# EAGLE schematic LogicPCB (EAGLE 9.4.2)
Assembly variants: СЫЧ

## Sheet 1 of 2
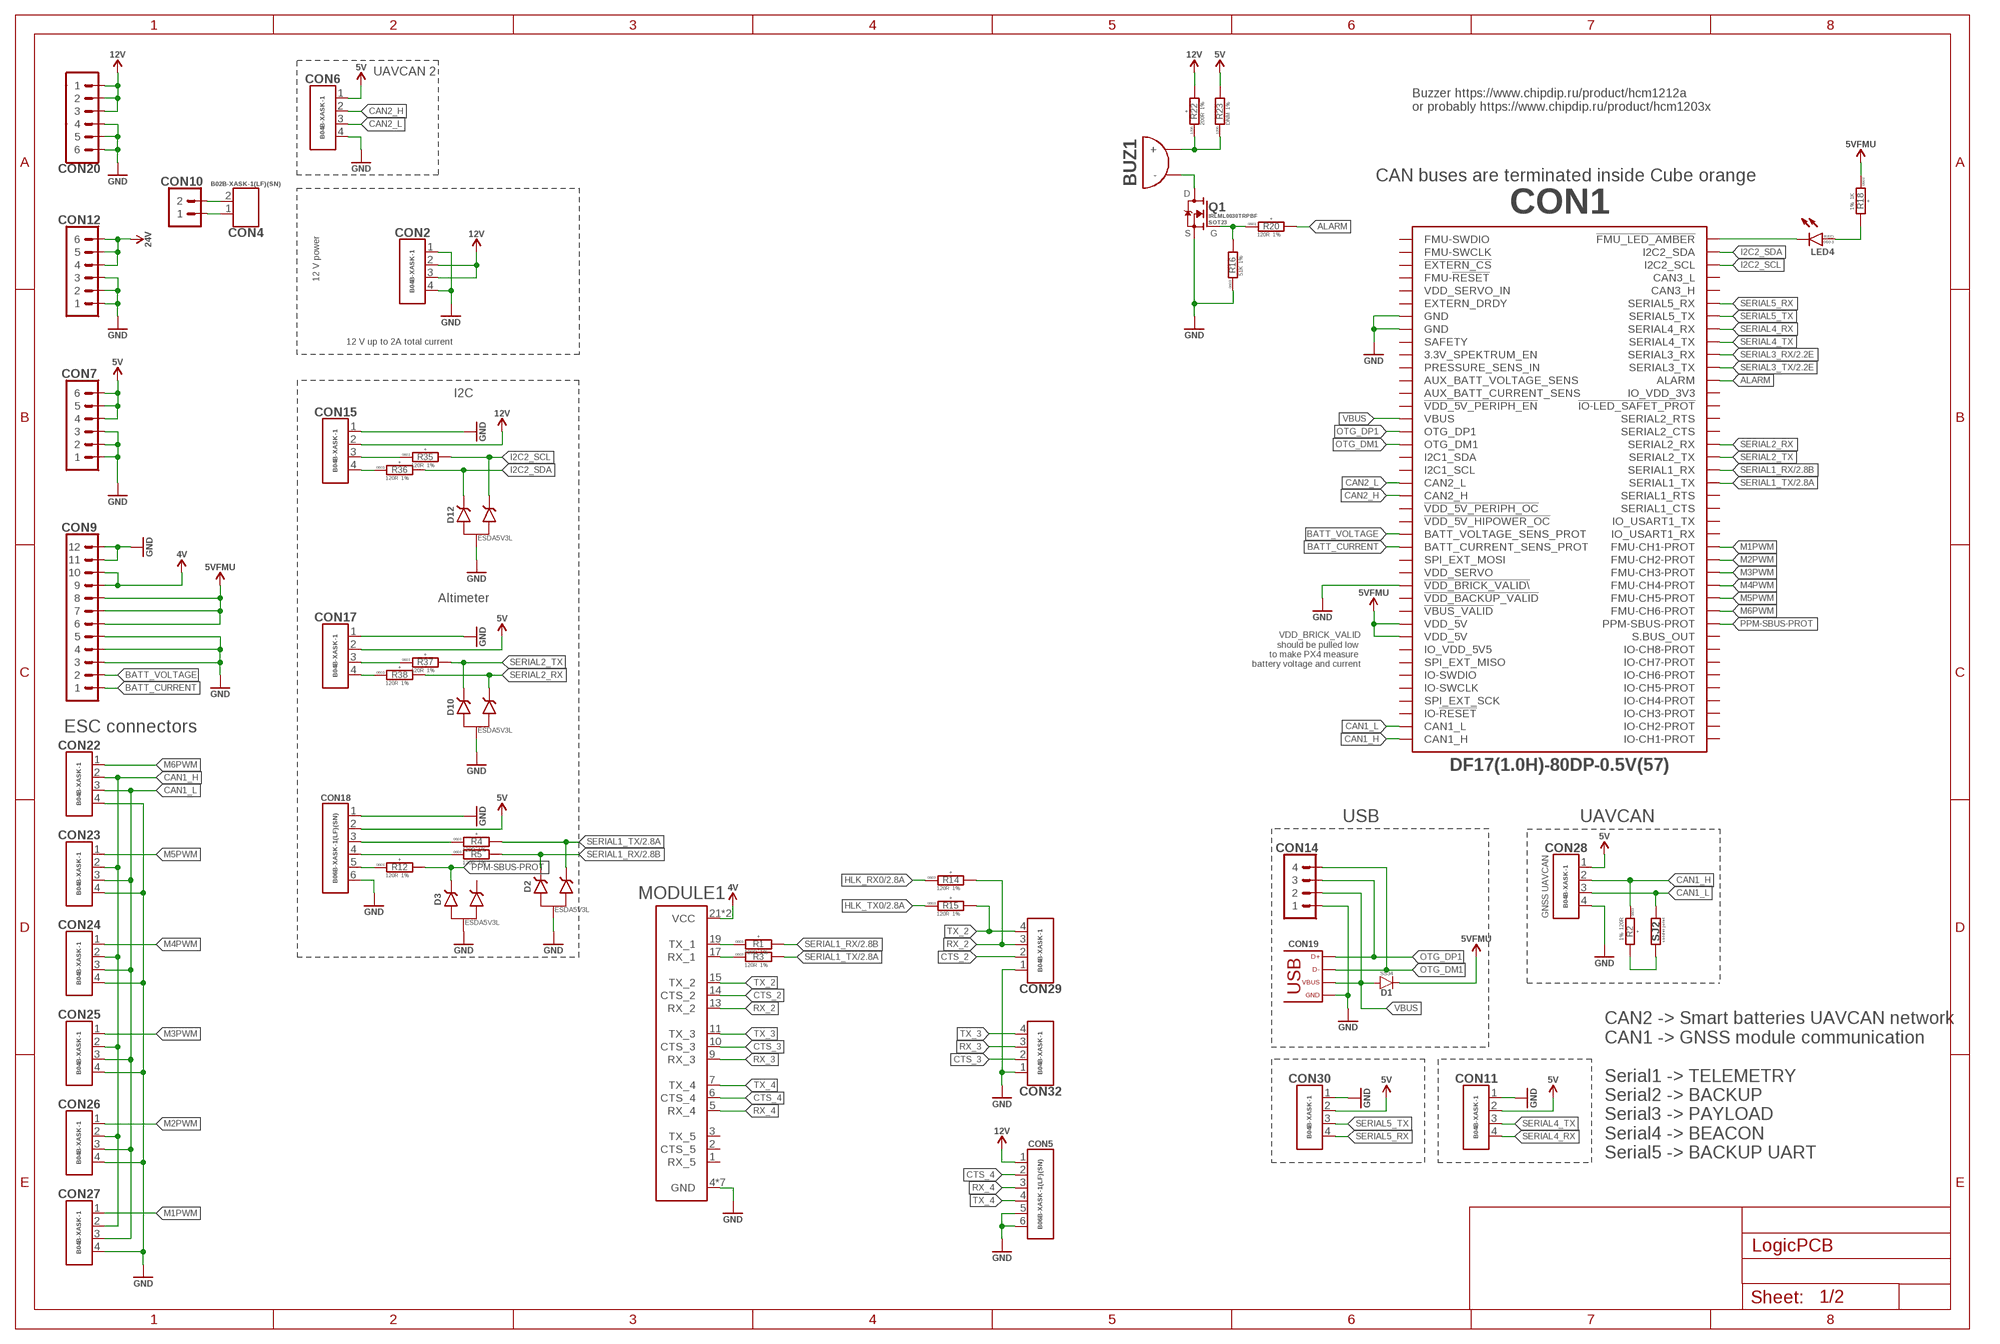
[diagram p0: schematic, sheet 1]

### Parts
BUZ1  BUZZER-ЕР-12MM  [BUZZER_12MM]
CON1  CUBE_ORANGE_  [CUBE_ORANGE]
CON2  CON-4P-JST-XA  [B04B-XASK-1]
CON4  CON-2P-JST-XA  [B02B-XASK-1]
CON5  CON-6P-JST-XA  [B06B-XASK-1]
CON6  CON-4P-JST-XA  [B04B-XASK-1]
CON7  PINHEAD_1X06-2.54  [1X06-PTH-2.54]
CON9  PINHEAD_1X12-2.54  [1X12-PTH-2.54]
CON10  PINHEAD_1X02-2.54  [1X02-PTH-2.54]
CON11  CON-4P-JST-XA  [B04B-XASK-1]
CON12  PINHEAD_1X06-2.54  [1X06-PTH-2.54]
CON14  PINHEAD_1X04-2.54  [1X04-PTH-2.54]  (not fitted in variant СЫЧ)
CON15  CON-4P-JST-XA  [B04B-XASK-1]
CON17  CON-4P-JST-XA  [B04B-XASK-1]
CON18  CON-6P-JST-XA  [B06B-XASK-1]
CON19  USB-TYPE-C-VERT-PROD  [2047110001-PROD]
CON20  PINHEAD_1X06-2.54  [1X06-PTH-2.54]
CON22  CON-4P-JST-XA  [B04B-XASK-1]
CON23  CON-4P-JST-XA  [B04B-XASK-1]
CON24  CON-4P-JST-XA  [B04B-XASK-1]
CON25  CON-4P-JST-XA  [B04B-XASK-1]
CON26  CON-4P-JST-XA  [B04B-XASK-1]
CON27  CON-4P-JST-XA  [B04B-XASK-1]
CON28  CON-4P-JST-XA  [B04B-XASK-1]
CON29  CON-4P-JST-XA  [B04B-XASK-1]
CON30  CON-4P-JST-XA  [B04B-XASK-1]
CON32  CON-4P-JST-XA  [B04B-XASK-1]
D1  SS34  [DO-214AC(SMA)]
D2  ESDA5V3L  [SOT23B-3]  (not fitted in variant СЫЧ)
D3  ESDA5V3L  [SOT23B-3]
D10  ESDA5V3L  [SOT23B-3]
D12  ESDA5V3L  [SOT23B-3]
LED4  LED-0603  [LED0603]
MODULE1  MODEM_CARRIER  [MODEM_CARRIER]
Q1  IRLML0030  [SOT23]
R1  120R  R-1%-0603  [R0603]
R2  120R  R-1%-0603  [R0603]
R3  120R  R-1%-0603  [R0603]
R4  120R  R-1%-0603  [R0603]  (not fitted in variant СЫЧ)
R5  120R  R-1%-0603  [R0603]  (not fitted in variant СЫЧ)
R12  120R  R-1%-0603  [R0603]
R14  120R  R-1%-0603  [R0603]  (not fitted in variant СЫЧ)
R15  120R  R-1%-0603  [R0603]  (not fitted in variant СЫЧ)
R16  51K  R-1%-0603  [R0603]
R18  1K  R-1%-0603  [R0603]
R20  120R  R-1%-0603  [R0603]
R22  200R  R-1%-1206  [R1206]
R23  DNM  R-1%-1206  [R1206]  (not fitted in variant СЫЧ)
R35  120R  R-1%-0603  [R0603]
R36  120R  R-1%-0603  [R0603]
R37  120R  R-1%-0603  [R0603]
R38  120R  R-1%-0603  [R0603]
SJ2  SOLDER_JOINT-SJ1  [RES_0]  (not fitted in variant СЫЧ)

### Nets
5VFMU: CON1.61(VDD_5V) CON1.63(VDD_5V) CON9.6 CON9.7 CON9.8 D1.C R18.1
!FMU_LED_AMBER: CON1.2(!FMU_LED_AMBER) LED4.C
ALARM: CON1.24(ALARM) R20.2
BATT_CURRENT: CON1.49(BATT_CURRENT_SENS_PROT) CON9.1
BATT_VOLTAGE: CON1.47(BATT_VOLTAGE_SENS_PROT) CON9.2
CAN1_H: CON1.79(CAN1_H) CON22.2 CON23.2 CON24.2 CON25.2 CON26.2 CON27.2 CON28.2 R2.1
CAN1_L: CON1.77(CAN1_L) CON22.3 CON23.3 CON24.3 CON25.3 CON26.3 CON27.3 CON28.3 SJ2.2
CAN2_H: CON1.41(CAN2_H) CON6.2
CAN2_L: CON1.39(CAN2_L) CON6.3
CTS_2: CON29.2 MODULE1.14(CTS_2)
CTS_3: CON32.2 MODULE1.10(CTS_3)
CTS_4: CON5.2 MODULE1.6(CTS_4)
GND: CON1.13(GND) CON1.15(GND) CON1.55(!VDD_BRICK_VALID\) CON2.1 CON2.4 CON5.5 CON5.6 CON6.4 CON7.1 CON7.2 CON7.3 CON9.3 CON9.4 CON9.5 CON9.11 CON9.12 CON11.1 CON12.1 CON12.2 CON12.3 CON14.1 CON15.1 CON17.1 CON18.1 CON18.6 CON19.A1(GND) CON19.A12(GND) CON19.B1(GND) CON19.B12(GND) CON19.G1(GND) CON19.G2(GND) CON19.G4(GND) CON19.G5(GND) CON19.G7(GND) CON19.G8(GND) CON19.G9(GND) CON19.G10(GND) CON19.P$1(GND) CON19.P$2(GND) CON20.4 CON20.5 CON20.6 CON22.4 CON23.4 CON24.4 CON25.4 CON26.4 CON27.4 CON28.4 CON29.1 CON30.1 CON32.1 D2.3(A) D3.3(A) D10.3(A) D12.3(A) MODULE1.4(GND) MODULE1.8(GND) MODULE1.12(GND) MODULE1.16(GND) MODULE1.20(GND) MODULE1.22(GND) MODULE1.24(GND) Q1.2(S) R16.1 ; also sheet 2
HLK_RX0: R14.1 ; also sheet 2
HLK_TX0: R15.1 ; also sheet 2
I2C2_SCL: CON1.6(I2C2_SCL) D12.2(C1) R35.2
I2C2_SDA: CON1.4(I2C2_SDA) D12.1(C) R36.2
M1PWM: CON1.50(FMU-CH1-PROT) CON27.1
M2PWM: CON1.52(FMU-CH2-PROT) CON26.1
M3PWM: CON1.54(FMU-CH3-PROT) CON25.1
M4PWM: CON1.56(FMU-CH4-PROT) CON24.1
M5PWM: CON1.58(FMU-CH5-PROT) CON23.1
M6PWM: CON1.60(FMU-CH6-PROT) CON22.1
N$1: LED4.A R18.2
N$2: CON4.1 CON10.1
N$3: BUZ1.2(-) Q1.3(D)
N$4: MODULE1.19(TX_1) R1.1
N$5: Q1.1(G) R16.2 R20.1
N$6: MODULE1.17(RX_1) R3.1
N$7: CON4.2 CON10.2
N$8: R2.2 SJ2.1
N$9: CON18.3 R4.1
N$10: CON18.4 R5.1
N$13: BUZ1.1(+) R22.P$1 R23.P$1
N$18: CON18.5 R12.1
N$20: CON15.3 R35.1
N$21: CON15.4 R36.1
N$22: CON17.3 R37.1
N$23: CON17.4 R38.1
OTG_DM1: CON1.33(OTG_DM1) CON14.4 CON19.A7(D-) CON19.B7(D-)
OTG_DP1: CON1.31(OTG_DP1) CON14.3 CON19.A6(D+) CON19.B6(D+)
PPM-SBUS-PROT: CON1.62(PPM-SBUS-PROT) D3.1(C) R12.2
RX_2: CON29.3 MODULE1.13(RX_2) R14.2
RX_3: CON32.3 MODULE1.9(RX_3)
RX_4: CON5.3 MODULE1.5(RX_4)
SERIAL1_RX: CON1.38(SERIAL1_RX) D2.1(C) R1.2 R5.2 ; also sheet 2
SERIAL1_TX: CON1.40(SERIAL1_TX) D2.2(C1) R3.2 R4.2 ; also sheet 2
SERIAL2_RX: CON1.34(SERIAL2_RX) D10.2(C1) R38.2
SERIAL2_TX: CON1.36(SERIAL2_TX) D10.1(C) R37.2
SERIAL3_RX: CON1.20(SERIAL3_RX) ; also sheet 2
SERIAL3_TX: CON1.22(SERIAL3_TX) ; also sheet 2
SERIAL4_RX: CON1.16(SERIAL4_RX) CON11.4
SERIAL4_TX: CON1.18(SERIAL4_TX) CON11.3
SERIAL5_RX: CON1.12(SERIAL5_RX) CON30.4
SERIAL5_TX: CON1.14(SERIAL5_TX) CON30.3
TX_2: CON29.4 MODULE1.15(TX_2) R15.2
TX_3: CON32.4 MODULE1.11(TX_3)
TX_4: CON5.4 MODULE1.7(TX_4)
VBUS: CON1.29(VBUS) CON14.2 CON19.A4(VBUS) CON19.B4(VBUS) D1.A
VDD_4V: CON9.9 CON9.10 MODULE1.21(VCC) MODULE1.23(VCC) ; supply symbol labelled 4V
VDD_5V: CON6.1 CON7.4 CON7.5 CON7.6 CON11.2 CON17.2 CON18.2 CON28.1 CON30.2 R23.P$2 ; supply symbol labelled 5V
VDD_12V: CON2.2 CON2.3 CON5.1 CON15.2 CON20.1 CON20.2 CON20.3 R22.P$2 ; supply symbol labelled 12V ; also sheet 2
VDD_24V: CON12.4 CON12.5 CON12.6 ; supply symbol labelled 24V ; also sheet 2
Unconnected: CON1.1(FMU-SWDIO) CON1.3(FMU-SWCLK) CON1.5(!EXTERN_CS) CON1.7(FMU-!RESET) CON1.8(CAN3_L) CON1.9(VDD_SERVO_IN) CON1.10(CAN3_H) CON1.11(EXTERN_DRDY) CON1.17(SAFETY) CON1.19(3.3V_SPEKTRUM_EN) CON1.21(PRESSURE_SENS_IN) CON1.23(AUX_BATT_VOLTAGE_SENS) CON1.25(AUX_BATT_CURRENT_SENS) CON1.26(IO_VDD_3V3) CON1.27(!VDD_5V_PERIPH_EN) CON1.28(!IO-LED_SAFET_PROT) CON1.30(SERIAL2_RTS) CON1.32(SERIAL2_CTS) CON1.35(I2C1_SDA) CON1.37(I2C1_SCL) CON1.42(SERIAL1_RTS) CON1.43(!VDD_5V_PERIPH_OC) CON1.44(SERIAL1_CTS) CON1.45(!VDD_5V_HIPOWER_OC) CON1.46(IO_USART1_TX) CON1.48(IO_USART1_RX) CON1.51(SPI_EXT_MOSI) CON1.53(VDD_SERVO) CON1.57(!VDD_BACKUP_VALID) CON1.59(!VBUS_VALID) CON1.64(S.BUS_OUT) CON1.65(IO_VDD_5V5) CON1.66(IO-CH8-PROT) CON1.67(SPI_EXT_MISO) CON1.68(IO-CH7-PROT) CON1.69(IO-SWDIO) CON1.70(IO-CH6-PROT) CON1.71(IO-SWCLK) CON1.72(IO-CH5-PROT) CON1.73(SPI_EXT_SCK) CON1.74(IO-CH4-PROT) CON1.75(IO-!RESET) CON1.76(IO-CH3-PROT) CON1.78(IO-CH2-PROT) CON1.80(IO-CH1-PROT) D3.2(C1) MODULE1.1(RX_5) MODULE1.2(CTS_5) MODULE1.3(TX_5)

### Notes on the sheet
- UAVCAN 2
- Buzzer https://www.chipdip.ru/product/hcm1212a
  or probably https://www.chipdip.ru/product/hcm1203x
- CAN buses are terminated inside Cube orange
- 12 V power
- 12 V up to 2A total current
- I2C
- Altimeter
- VDD_BRICK_VALID
  should be pulled low 
  to make PX4 measure 
  battery voltage and current
- ESC connectors
- USB | UAVCAN
- GNSS UAVCAN
- CAN2 -> Smart batteries UAVCAN network
  CAN1 -> GNSS module communication
  
  Serial1 -> TELEMETRY
  Serial2 -> BACKUP 
  Serial3 -> PAYLOAD
  Serial4 -> BEACON
  Serial5 -> BACKUP UART

## Sheet 2 of 2
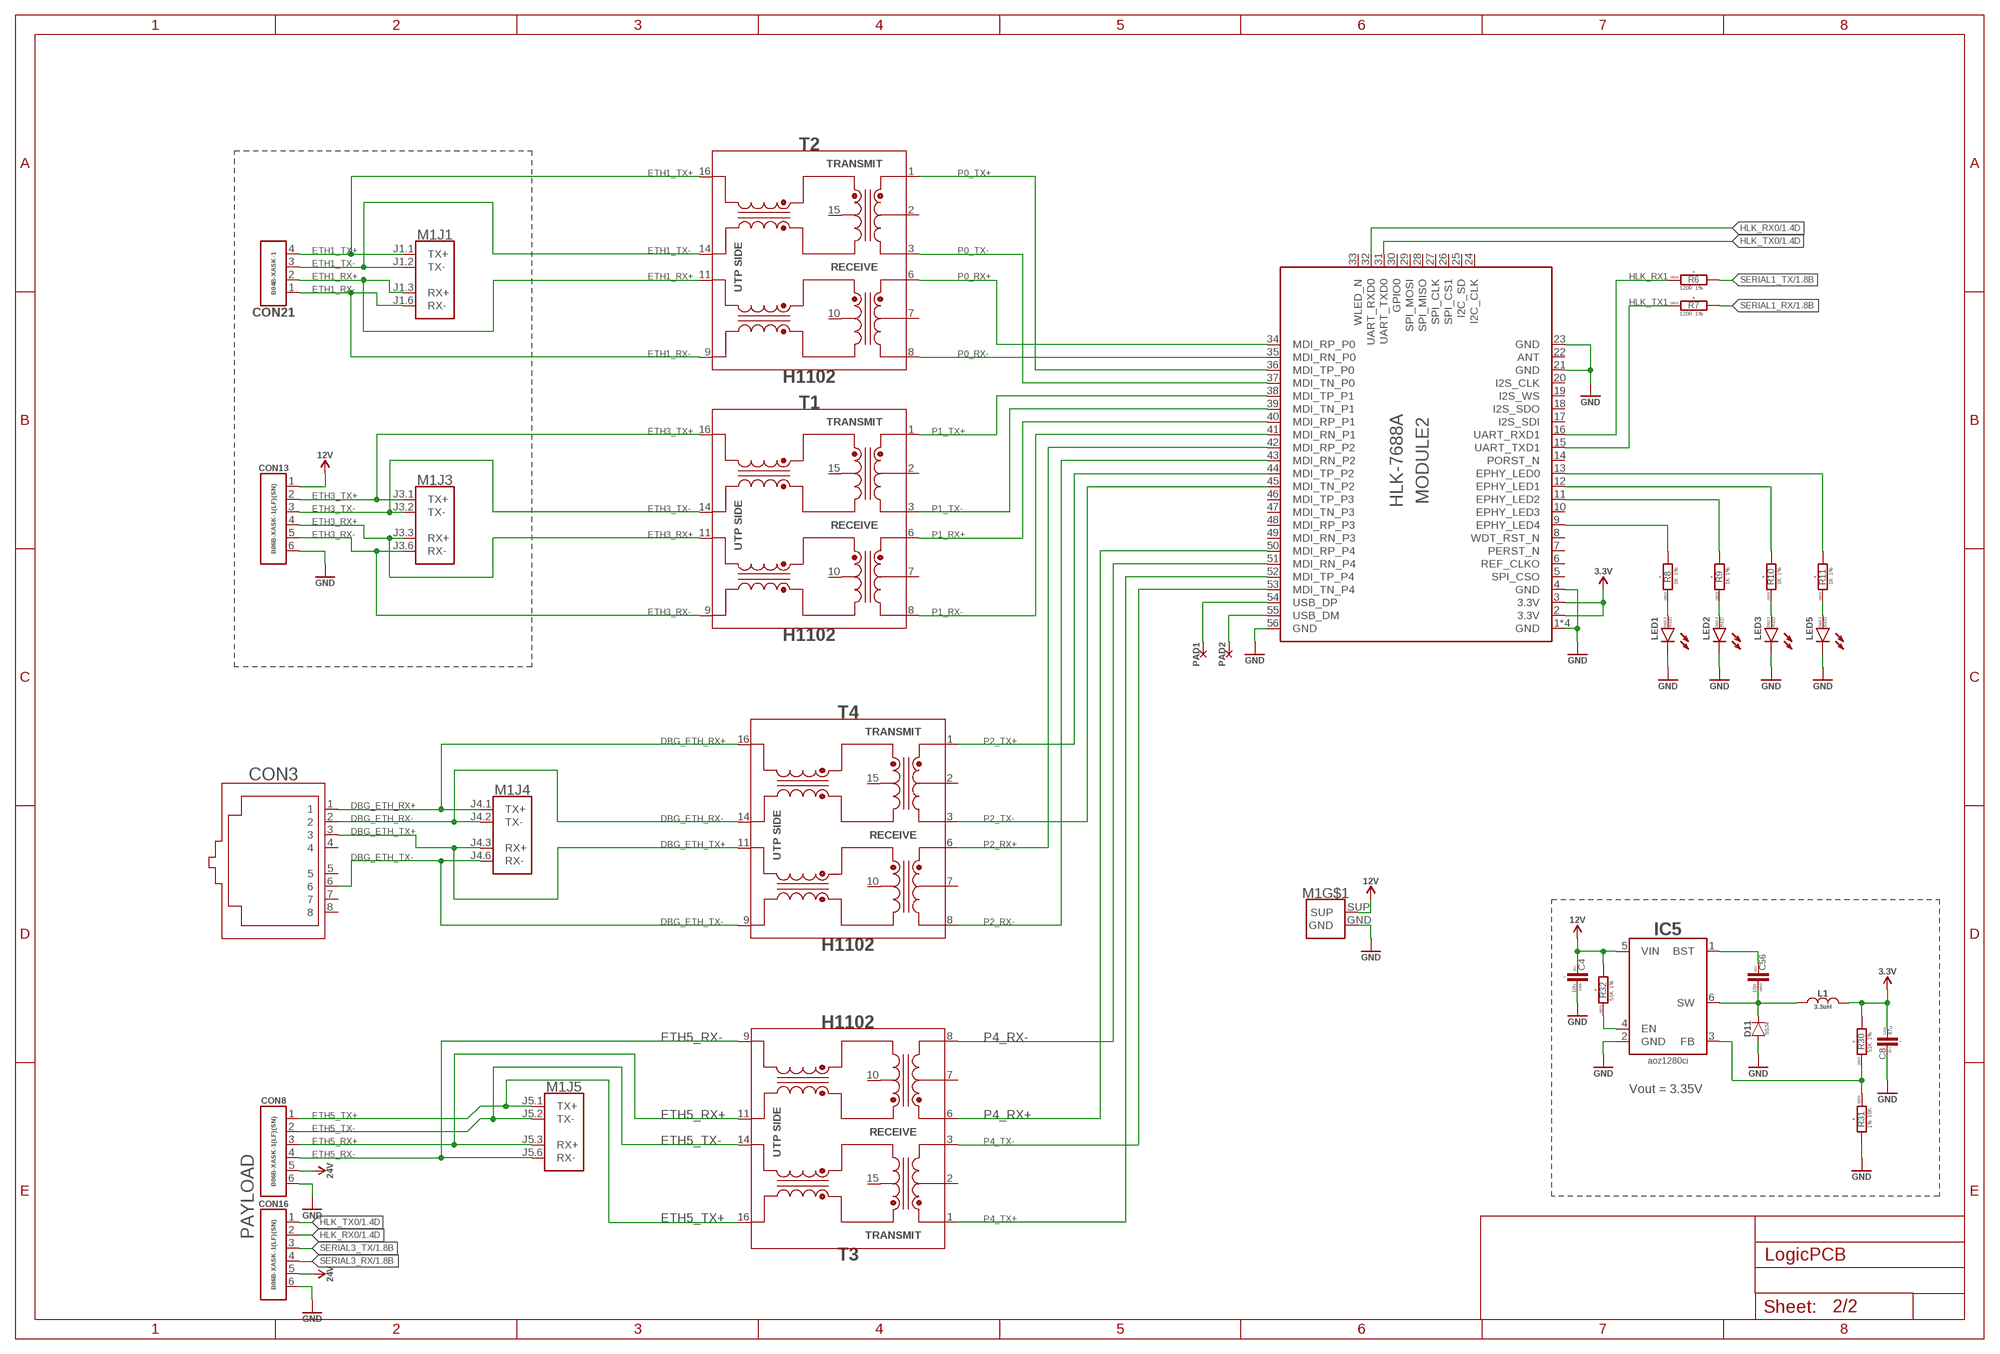
[diagram p1: schematic, sheet 2]

### Parts
C4  10u  C-1206  [C1206]  (not fitted in variant СЫЧ)
C8  47u  C-1206  [C1206]  (not fitted in variant СЫЧ)
C56  10n  C-0603  [C0603]  (not fitted in variant СЫЧ)
CON3  RJ45-NO_SHIELD-5556416-1  [5556416-1]
CON8  CON-6P-JST-XA  [B06B-XASK-1]
CON13  CON-6P-JST-XA  [B06B-XASK-1]
CON16  CON-6P-JST-XA  [B06B-XASK-1]
CON21  CON-4P-JST-XA  [B04B-XASK-1]
D11  SS34  [DO-214AC(SMA)]  (not fitted in variant СЫЧ)
IC5  AOZ1280  [SOT23-6]  (not fitted in variant СЫЧ)
L1  3.3uH  3.3µH-IHLP-202BZ  [IHLP-2020BZ-01]  (not fitted in variant СЫЧ)
LED1  LED-0603  [LED0603]  (not fitted in variant СЫЧ)
LED2  LED-0603  [LED0603]  (not fitted in variant СЫЧ)
LED3  LED-0603  [LED0603]  (not fitted in variant СЫЧ)
LED5  LED-0603  [LED0603]  (not fitted in variant СЫЧ)
M1  05G_ETHERNET_SWITCH  [05G_ETH_SWITCH]
MODULE2  HLK-7688A  [HLK-7688A]  (not fitted in variant СЫЧ)
PAD1  PAD-HEX-2MM  [HEX-2MM]  (not fitted in variant СЫЧ)
PAD2  PAD-HEX-2MM  [HEX-2MM]  (not fitted in variant СЫЧ)
R6  120R  R-1%-0603  [R0603]  (not fitted in variant СЫЧ)
R7  120R  R-1%-0603  [R0603]  (not fitted in variant СЫЧ)
R8  1K  R-1%-0603  [R0603]  (not fitted in variant СЫЧ)
R9  1K  R-1%-0603  [R0603]  (not fitted in variant СЫЧ)
R10  1K  R-1%-0603  [R0603]  (not fitted in variant СЫЧ)
R11  1K  R-1%-0603  [R0603]  (not fitted in variant СЫЧ)
R30  51K  R-1%-0603  [R0603]  (not fitted in variant СЫЧ)
R31  16K  R-1%-0603  [R0603]  (not fitted in variant СЫЧ)
R32  51K  R-1%-0603  [R0603]  (not fitted in variant СЫЧ)
T1  H1102NL  [H1102]  (not fitted in variant СЫЧ)
T2  H1102NL  [H1102]  (not fitted in variant СЫЧ)
T3  H1102NL  [H1102]  (not fitted in variant СЫЧ)
T4  H1102NL  [H1102]  (not fitted in variant СЫЧ)

### Nets
DBG_ETH_RX+: CON3.1 M1.J4.1(J4:TX+) T4.16
DBG_ETH_RX-: CON3.2 M1.J4.2(J4:TX-) T4.14
DBG_ETH_TX+: CON3.3 M1.J4.3(J4:RX+) T4.11
DBG_ETH_TX-: CON3.6 M1.J4.6(J4:RX-) T4.9
ETH1_RX+: CON21.2 M1.J1.3(J1:RX+) T2.11
ETH1_RX-: CON21.1 M1.J1.6(J1:RX-) T2.9
ETH1_TX+: CON21.4 M1.J1.1(J1:TX+) T2.16
ETH1_TX-: CON21.3 M1.J1.2(J1:TX-) T2.14
ETH3_RX+: CON13.4 M1.J3.3(J3:RX+) T1.11
ETH3_RX-: CON13.5 M1.J3.6(J3:RX-) T1.9
ETH3_TX+: CON13.2 M1.J3.1(J3:TX+) T1.16
ETH3_TX-: CON13.3 M1.J3.2(J3:TX-) T1.14
ETH5_RX+: CON8.3 M1.J5.3(J5:RX+) T3.11
ETH5_RX-: CON8.4 M1.J5.6(J5:RX-) T3.9
ETH5_TX+: CON8.1 M1.J5.1(J5:TX+) T3.16
ETH5_TX-: CON8.2 M1.J5.2(J5:TX-) T3.14
GND: C4.P$1 C8.P$2 CON8.6 CON13.6 CON16.6 D11.A IC5.2(GND) LED1.C LED2.C LED3.C LED5.C M1.GND MODULE2.1(GND) MODULE2.4(GND) MODULE2.21(GND) MODULE2.23(GND) MODULE2.56(GND) MODULE2.P$1(GND) MODULE2.P$2(GND) MODULE2.P$3(GND) R31.2 ; also sheet 1
HLK_RX0: CON16.2 MODULE2.32(UART_RXD0) ; also sheet 1
HLK_RX1: MODULE2.16(UART_RXD1) R6.1
HLK_TX0: CON16.1 MODULE2.31(UART_TXD0) ; also sheet 1
HLK_TX1: MODULE2.15(UART_TXD1) R7.1
LINK2: MODULE2.11(EPHY_LED2) R9.2
LINK4: MODULE2.9(EPHY_LED4) R8.2
N$11: LED1.A R8.1
N$12: LED2.A R9.1
N$14: LED3.A R10.1
N$15: LED5.A R11.1
N$16: MODULE2.12(EPHY_LED1) R10.2
N$17: MODULE2.13(EPHY_LED0) R11.2
N$88: C56.2 IC5.1(BST)
N$90: IC5.3(FB) R30.1 R31.1
N$91: IC5.4(EN) R32.1
P0_RX+: MODULE2.34(MDI_RP_P0) T2.6
P0_RX-: MODULE2.35(MDI_RN_P0) T2.8
P0_TX+: MODULE2.36(MDI_TP_P0) T2.1
P0_TX-: MODULE2.37(MDI_TN_P0) T2.3
P1_RX+: MODULE2.40(MDI_RP_P1) T1.6
P1_RX-: MODULE2.41(MDI_RN_P1) T1.8
P1_TX+: MODULE2.38(MDI_TP_P1) T1.1
P1_TX-: MODULE2.39(MDI_TN_P1) T1.3
P2_RX+: MODULE2.42(MDI_RP_P2) T4.6
P2_RX-: MODULE2.43(MDI_RN_P2) T4.8
P2_TX+: MODULE2.44(MDI_TP_P2) T4.1
P2_TX-: MODULE2.45(MDI_TN_P2) T4.3
P4_RX+: MODULE2.50(MDI_RP_P4) T3.6
P4_RX-: MODULE2.51(MDI_RN_P4) T3.8
P4_TX+: MODULE2.52(MDI_TP_P4) T3.1
P4_TX-: MODULE2.53(MDI_TN_P4) T3.3
SERIAL1_RX: R7.2 ; also sheet 1
SERIAL1_TX: R6.2 ; also sheet 1
SERIAL3_RX: CON16.4 ; also sheet 1
SERIAL3_TX: CON16.3 ; also sheet 1
SW: C56.1 D11.C IC5.6(SW) L1.P$1
USB_DM: MODULE2.55(USB_DM) PAD2.1
USB_DP: MODULE2.54(USB_DP) PAD1.1
VDD_3V3: C8.P$1 L1.P$2 MODULE2.2(3.3V) MODULE2.3(3.3V) R30.2 ; supply symbol labelled 3.3V
VDD_12V: C4.P$2 CON13.1 IC5.5(VIN) M1.SUP R32.2 ; supply symbol labelled 12V ; also sheet 1
VDD_24V: CON8.5 CON16.5 ; supply symbol labelled 24V ; also sheet 1
Unconnected: CON3.4 CON3.5 CON3.7 CON3.8 M1.J2.1(J2:TX+) M1.J2.2(J2:TX-) M1.J2.3(J2:RX+) M1.J2.6(J2:RX-) MODULE2.5(SPI_CSO) MODULE2.6(REF_CLKO) MODULE2.7(PERST_N) MODULE2.8(WDT_RST_N) MODULE2.10(EPHY_LED3) MODULE2.14(PORST_N) MODULE2.17(I2S_SDI) MODULE2.18(I2S_SDO) MODULE2.19(I2S_WS) MODULE2.20(I2S_CLK) MODULE2.22(ANT) MODULE2.24(I2C_CLK) MODULE2.25(I2C_SD) MODULE2.26(SPI_CS1) MODULE2.27(SPI_CLK) MODULE2.28(SPI_MISO) MODULE2.29(SPI_MOSI) MODULE2.30(GPIO0) MODULE2.33(WLED_N) MODULE2.46(MDI_TP_P3) MODULE2.47(MDI_TN_P3) MODULE2.48(MDI_RP_P3) MODULE2.49(MDI_RN_P3) T1.2 T1.7 T1.10 T1.15 T2.2 T2.7 T2.10 T2.15 T3.2 T3.7 T3.10 T3.15 T4.2 T4.7 T4.10 T4.15

### Notes on the sheet
- Vout = 3.35V
- PAYLOAD

## Library data of the parts
BUZ1 = misc:BUZZER; MANF: JL World; MANF#: HCM1212A
C4 = rc:C; ALLOCATED: +; LCSC#: C77090; MANF: Murata Electronics; MANF#: GRM31CR61E106KA12L; OPERATING_TEMP: -55 to 85 ℃; PACKAGE: 1206; VOLTAGE: 25V
C8 = rc:C; ALLOCATED: +; LCSC#: C403725; MANF: Murata Electronics; MANF#: GRM31CR61E476ME44L; PACKAGE: 1206; VOLTAGE: 25V
C56 = rc:C; PACKAGE: 0603; VOLTAGE: 50V
CON1 = misc:CUBE_ORANGE; MANF: HIROSE; MANF#: DF17(1.0H)-80DP-0.5V(57)
CON2 CON6 CON11 CON15 CON17 CON21-CON30 CON32 = Connectors:CON-4P; LCSC#: C264994; MANF: JST Sales America; MANF#: B04B-XASK-1
CON3 = Connectors:RJ45-NO_SHIELD; LCSC#: C86492; MANF: TE Connectivity; MANF#: 5556416-1
CON4 = Connectors:CON-2P: Connector 2 position; LCSC#: C263753; MANF: JST Sales America; MANF#: B02B-XASK-1(LF)(SN)
CON5 CON8 CON13 CON16 CON18 = Connectors:CON-6P: Connector Header 6 position; LCSC#: C264995; MANF: JST Sales America; MANF#: B06B-XASK-1(LF)(SN)
CON7 CON12 CON20 = pinhead:PINHEAD_1X06: pinheader 6P
CON9 = pinhead:PINHEAD_1X12
CON10 = pinhead:PINHEAD_1X02: pinheader 2P
CON14 = pinhead:PINHEAD_1X04
CON19 = Connectors:USB: Connector Receptacle USB 2; LCSC#: C381139; MANF: Molex; MANF#: 2047110001
D1 D11 = Diodes:SS34: 40V 3A 550mV @ 3A SMA(DO-214AC) Schottky Barrier Diodes; LCSC#: C8678; MANF: MDD（Microdiode Electronics）; MANF#: SS34
D2 D3 D10 D12 = TVS_diodes:ESDA5V3L: TVS DIODE 5.25VWM SOT23; DIGIKEY#: 497-2930-2-ND; LCSC#: C87911; MANF: STMicroelectronics; MANF#: ESDA5V3L
IC5 = dc-dc:AOZ1280: SOT23-6 DC-DC Converters ROHS; LCSC#: C41240; MANF: Alpha & Omega Semicon; MANF#: aoz1280ci
L1 = power_inductors:3.3µH; MANF: Vishay Precision Group; MANF#: IHLP2020BZER3R3M01
LED1-LED5 = rc:LED: Light emitting diode; COLOR: RED; LCSC#: C2286; MANF: Hubei KENTO Elec; MANF#: KT-0603R; PACKAGE: 0603
M1 = ali_modules:05G_ETHERNET_SWITCH
MODULE1 = Pegas_misc:MODEM_CARRIER
MODULE2 = ali_modules:HLK-7688A; MANF: Hi-link; MANF#: HLK-7688A
PAD1 PAD2 = PADS:PAD
Q1 = mosfet:IRLML0030: MOSFET N-CH 30V 5.3A SOT-23-3; DIGIKEY#: IRLML0030TRPBFTR-ND; LCSC#: C3647050; MANF: Infineon Technologies; MANF#: IRLML0030TRPBF; PACKAGE: SOT23
R1-R7 R12 R14 R15 R20 R35-R38 = rc:R; ALLOCATED: +; LCSC#: C22787; MANF: UNI-ROYAL(Uniroyal Elec); MANF#: 0603WAF1200T5E; PACKAGE: 0603; TOLERANCE: 1%
R8-R11 R18 = rc:R; ALLOCATED: +; LCSC#: C21190; MANF: UNI-ROYAL(Uniroyal Elec); MANF#: 0603WAF1001T5E; PACKAGE: 0603; TOLERANCE: 1%
R16 = rc:R; LCSC#: C23196; PACKAGE: 0603; TOLERANCE: 1%
R22 = rc:R; ALLOCATED: +; LCSC#: C25361; MANF: UNI-ROYAL; MANF#: 1206W4J0201T5E; PACKAGE: 1206; TOLERANCE: 1%
R23 = rc:R; PACKAGE: 1206; TOLERANCE: 1%
R30 R32 = rc:R; ALLOCATED: +; LCSC#: C23196; PACKAGE: 0603; TOLERANCE: 1%
R31 = rc:R; ALLOCATED: +; LCSC#: C25804; PACKAGE: 0603; TOLERANCE: 1%
SJ2 = misc:SOLDER_JOINT
T1-T4 = misc:H1102NL: MODULE XFRMR SGL ETHR LAN 16SOIC; DIGIKEY#: 553-1203-ND; MANF: Pulse Electronics Corporation; MANF#: H1102

## Net classes
1 HV: clearance 0.3 mm to class 0, clearance 0.3 mm